# EAGLE design 2003_converter_cc2tc (EAGLE 9.6.2)
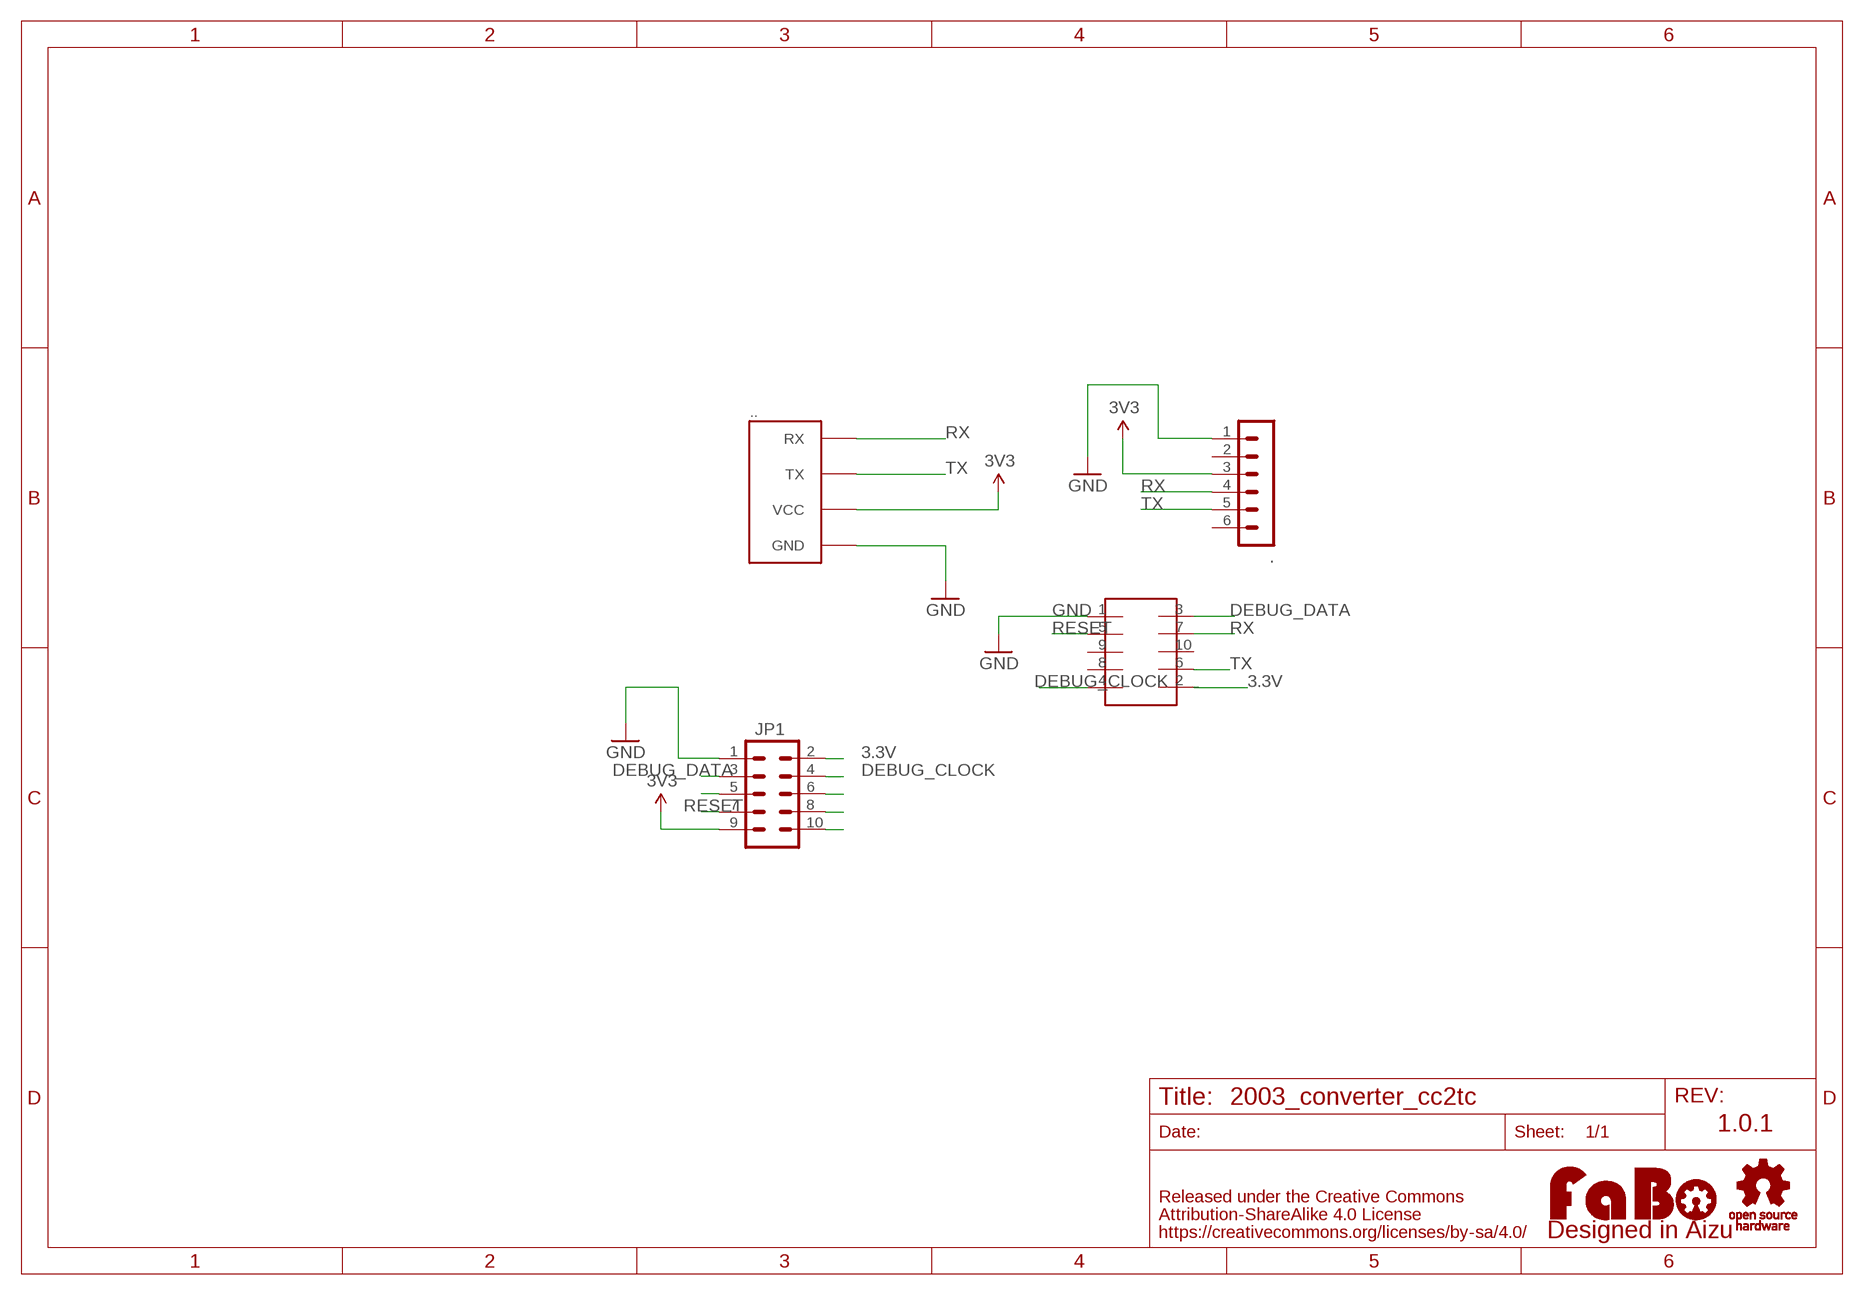
[diagram p0: schematic, sheet 1]

## Parts
.  MA06-1  [MA06-1]
..  FABO_BRICK_SERIAL-S04B-PASK-2  [FABO_BRICK_SERIAL_S04B-PASK-2]
JP1  M05X2SHD  [2X5-SHROUDED]
U$1  LOGO_OSHW-M_BOTTOM  [LOGO_OSHW_M_BOTTOM]
U$2  LOGO_FABO-M  [LOGO_FABO_MS]
U$4  TC-2050-SOCKET  [TC-2050-SOCKET]

## Nets
3.3V: JP1.2 U$4.2
3V3: ..3 ...VCC JP1.9
CSN: JP1.5
DEBUG_CLOCK: JP1.4 U$4.4
DEBUG_DATA: JP1.3 U$4.3
GND: ..1 ...GND JP1.1 U$4.1
MISO: JP1.10
MOSI: JP1.8
RESET: JP1.7 U$4.5
RX: ..4 ...RX U$4.7
SCLK: JP1.6
TX: ..5 ...TX U$4.6
Unconnected: ..2 ..6 U$4.8 U$4.9 U$4.10

## Notes on the sheet
- 1.0.1

## Library data of the parts
. = con-lstb:MA06-1: PIN HEADER; OC_FARNELL: unknown; OC_NEWARK: unknown
.. = FaBo-Template:FABO_BRICK_SERIAL: FaBo Brick Serial
JP1 = SparkFun-Connectors:M05X2: Header 5x2 Standard 10-pin dual row 0.1" header. Commonly used with AVR-ISP. Use with Spark Fun Electronics SKU: PRT-00778
U$1 = FaBo-Logo:LOGO_OSHW
U$2 = FaBo-Logo:LOGO_FABO
U$4 = GClue-Debbuger:TC-2050-SOCKET

## Board
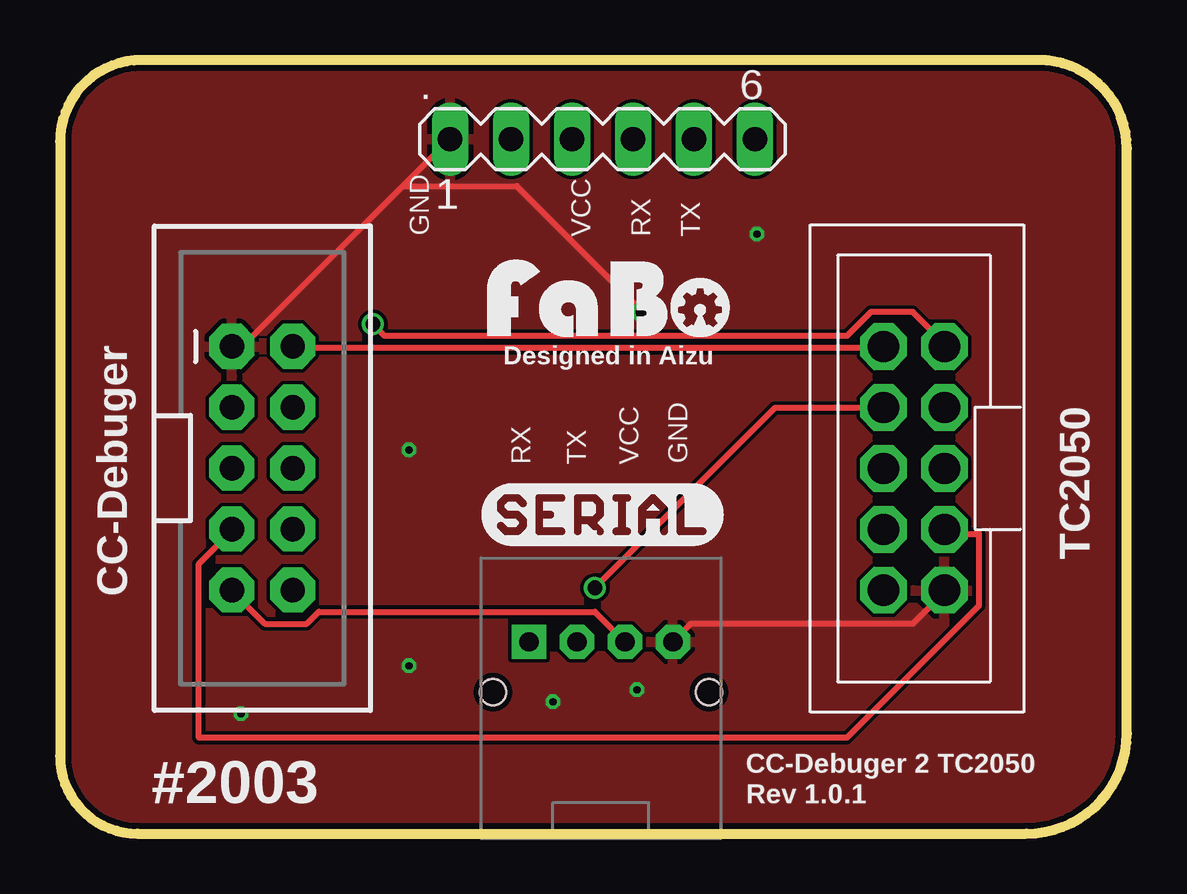
[diagram p1: board, top side]
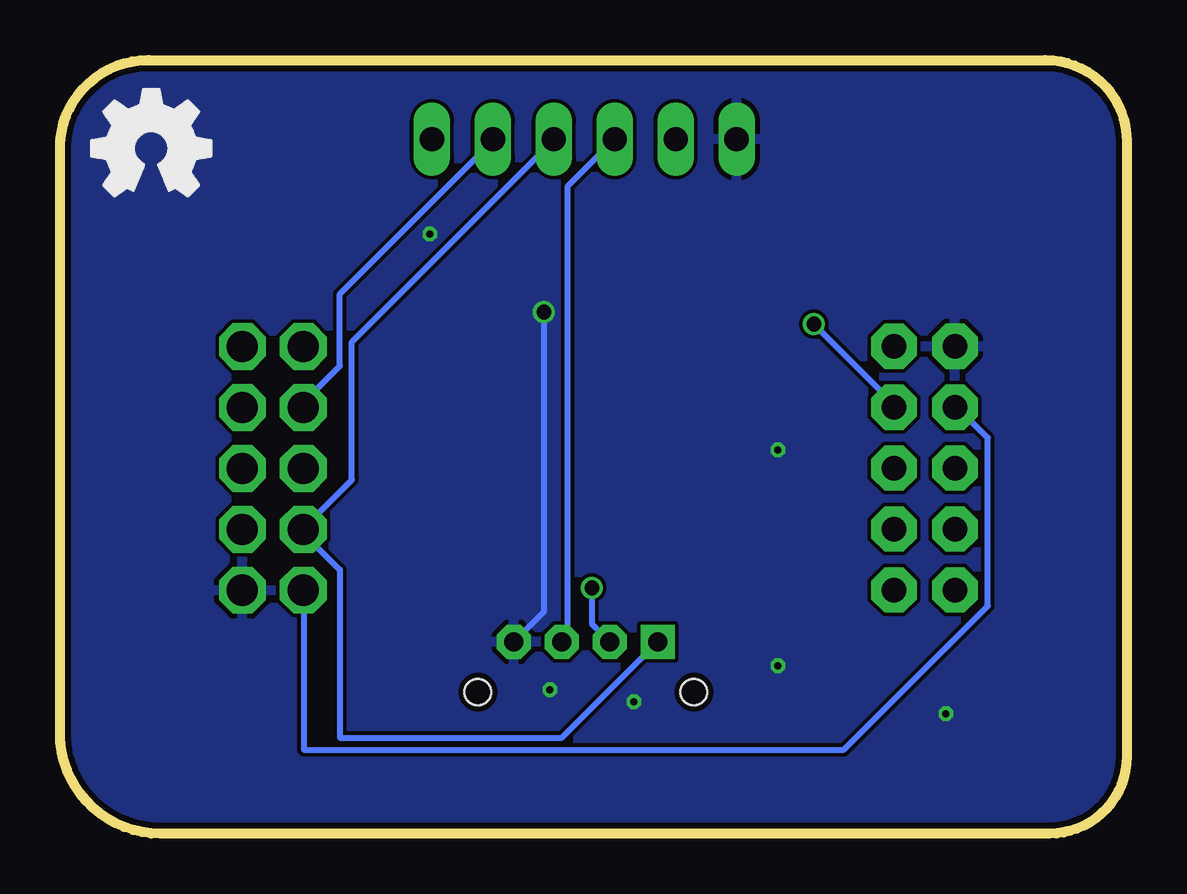
[diagram p2: board, bottom side, seen from below]

Size 44.45 x 32.26 mm. Coordinates in mm from the lower left corner, seen from the top.
Outline: 3.23,0 40.27,0 arc90 44.45,4.18 44.45,28.57 arc90 40.77,32.26 3.4,32.26 arc90 0,28.86 0,3.23 arc90 3.23,0
Copper layers (1*16): Top 0.035mm / dielectric 1.6mm / Bottom 0.035mm
Design rules "PCBway": minimum track width 6mil, minimum drill 12mil, track to track 6mil, track to pad 6mil, pad to pad 6mil, via to via 6mil, smd to smd 6mil, copper to edge 10mil, drill to drill 10mil, minimum pad ring 10mil, minimum via ring 6mil, stop-mask expansion 2mil, vias tented up to drill 100mil, thermal gap 8mil

### Footprints (pad centres in the part's own frame; a part is rotated, then mirrored left to right if it is on the bottom)
MA06-1 = drill 1.016 long: 1 -6.35,0; 2 -3.81,0; 3 -1.27,0; 4 1.27,0; 5 3.81,0; 6 6.35,0
FABO_BRICK_SERIAL_S04B-PASK-2 = drill 0.8 pad 1.422 octagon: GND -3,0; TX 1,0; VCC -1,0 | drill 0.8 pad 1.422 square: RX 3,0 | hole 1.1: 4.5,2.1; -4.5,2.1
2X5-SHROUDED = drill 1.016 pad 1.88 octagon: 1 -1.27,5.08; 2 1.27,5.08; 3 -1.27,2.54; 4 1.27,2.54; 5 -1.27,0; 6 1.27,0; 7 -1.27,-2.54; 8 1.27,-2.54; 9 -1.27,-5.08; 10 1.27,-5.08
TC-2050-SOCKET = drill 1.3 octagon: 1 1.27,-8.89; 2 -1.27,1.27; 3 -1.27,-8.89; 4 1.27,1.27; 5 1.27,-6.35; 6 -1.27,-1.27; 7 -1.27,-6.35; 8 1.27,-1.27; 9 1.27,-3.81; 10 -1.27,-3.81

### Placement (x,y rotation side)
.  22.61,28.96 0 top
..  22.54,8 180 top
JP1  8.43,15.24 0 top
U$1  40.64,28.57 0 top
U$2  22.86,20.32 0 top
U$4  35.58,19.04 0 top
U$5  [LOGO_SILK_SERIAL2]  17.54,12 0 top

### Tracks (layer width: path | path; a pad name or v marks a point on that pad's centre or on a via)
3.3V
  Top 0.254: JP1.2 9.79,20.25 34.29,20.25 U$4.2
3V3
  Top 0.254: ...VCC 22.29,9.25 10.79,9.25 10.29,8.75 8.54,8.75 7.29,10 JP1.9
  Bottom 0.254: ...VCC 23.29,8.25 23.29,27 21.54,28.75 ..3
DEBUG_CLOCK  (via drill 0.61)
  Top 0.254: v13.04,21.25 13.54,20.75 32.79,20.75 33.79,21.75 35.54,21.75 36.79,20.5 U$4.4
  Bottom 0.254: v13.04,21.25 9.79,18 JP1.4
DEBUG_DATA
  Bottom 0.254: JP1.3 7.04,17.75 5.79,16.5 5.79,9.5 11.79,3.5 34.29,3.5 34.29,10 U$4.3
GND  (via drill 0.3, 0.61)
  Top 0.254: ...GND 26.29,8.75 35.54,8.75 36.79,10 U$4.1 | 14.29,27 7.79,20.5 7.29,20.5 JP1.1 | 14.29,27 16.04,28.75 ..1 | v24.29,21.75 19.04,27 14.29,27
  Bottom 0.254: ...GND 24.29,9.25 v24.29,21.75
  other vias: 14.54,16 14.54,7 7.54,5 29.04,25 20.54,5.5 24.04,6
  pour Bottom: -0.46,-0.36 44.54,-0.36 44.54,33 -0.46,33
  pour Top: -0.46,-0.36 44.54,-0.36 44.54,33 -0.46,33
RESET
  Top 0.254: JP1.7 7.04,12.5 5.79,11.25 5.79,4 32.79,4 38.29,9.5 38.29,12.5 37.04,12.5 U$4.5
RX
  Bottom 0.254: ...RX 23.54,4 32.79,4 32.79,11 34.29,12.5 U$4.7 34.29,12.75 32.29,14.75 32.29,20.5 24.04,28.75 ..4
TX  (via drill 0.61)
  Top 0.254: v22.29,10.25 29.79,17.75 34.29,17.75 U$4.6
  Bottom 0.254: ...TX 22.29,8.75 v22.29,10.25 | ..5 26.54,28.75 32.79,22.5 32.79,19.5 34.29,18 U$4.6

### Text on the board
tPlace: GND | VCC | RX | TX | Designed in Aizu | RX | TX | VCC | GND | TC2050 | CC-Debuger | CC-Debuger 2 TC2050 | #2003 | Rev 1.0.1